# EAGLE design bms3ry (EAGLE 4.13)
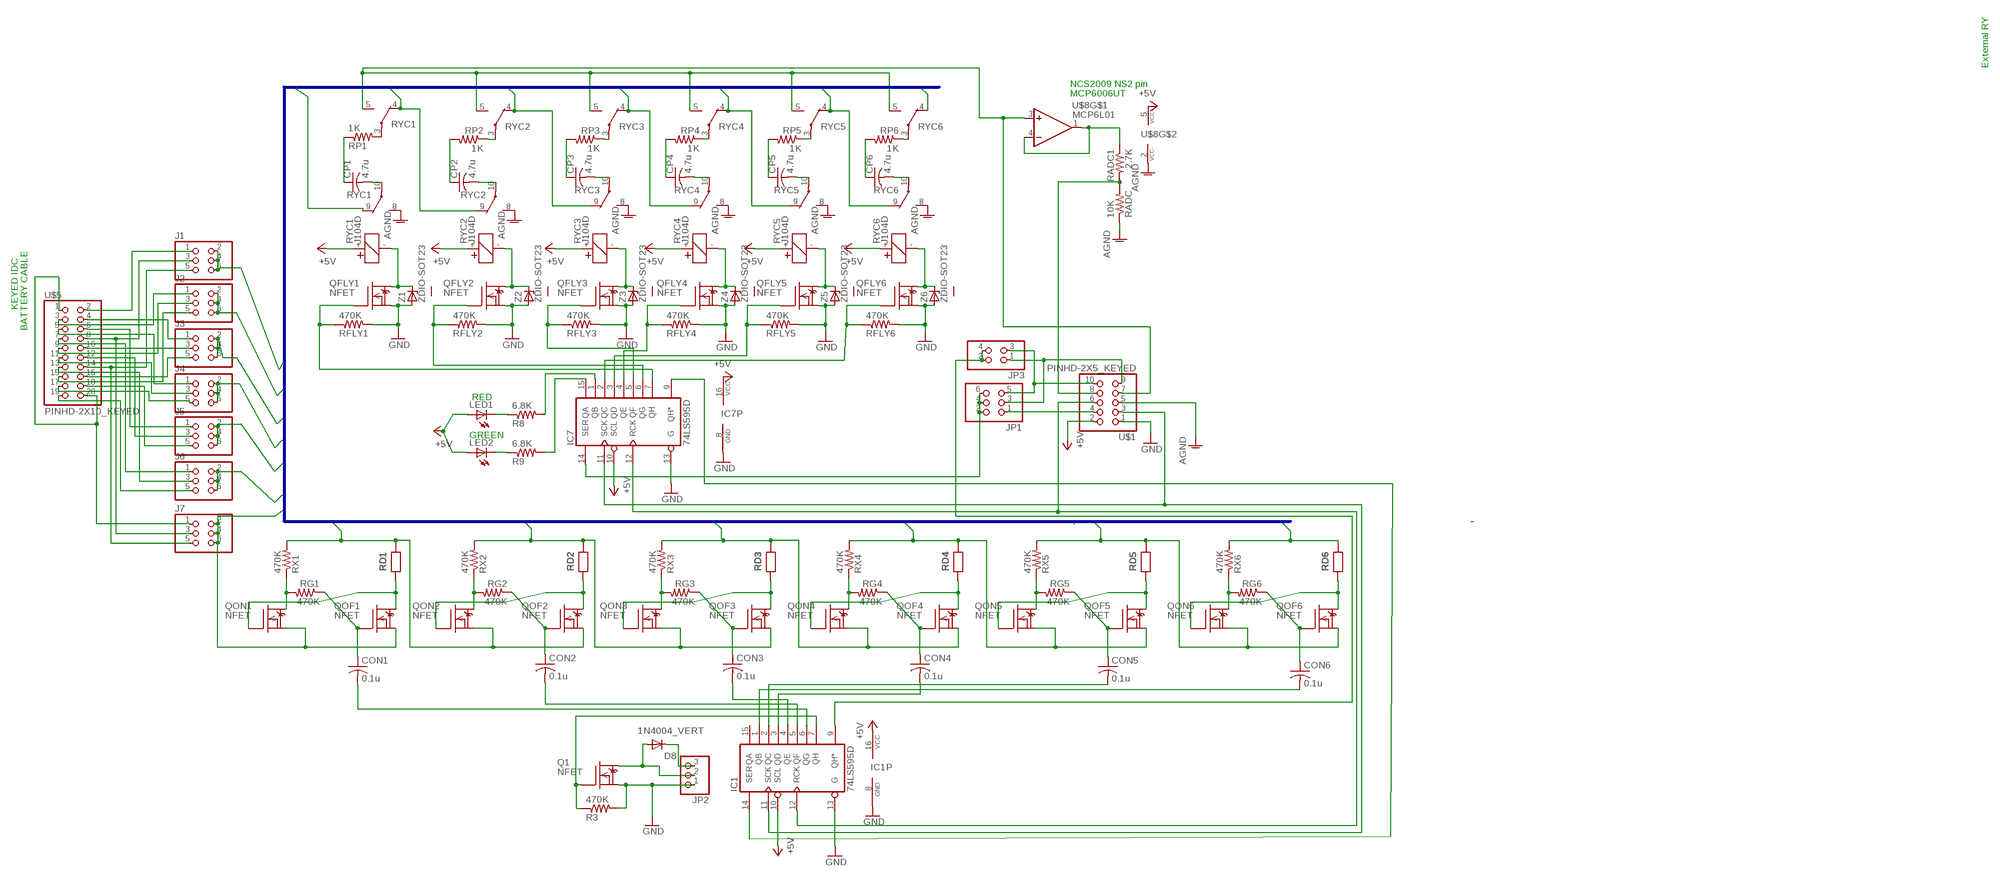
[diagram p0: schematic, sheet 1]

## Parts
CON1  0.1u  C-USC0603  [C0603]
CON2  0.1u  C-USC0603  [C0603]
CON3  0.1u  C-USC0603  [C0603]
CON4  0.1u  C-USC0603  [C0603]
CON5  0.1u  C-USC0603  [C0603]
CON6  0.1u  C-USC0603  [C0603]
CP1  4.7u  C-USC0805  [C0805]
CP2  4.7u  C-USC0805  [C0805]
CP3  4.7u  C-USC0805  [C0805]
CP4  4.7u  C-USC0805  [C0805]
CP5  4.7u  C-USC0805  [C0805]
CP6  4.7u  C-USC0805  [C0805]
D8  1N4004_VERT  [DO41-10_VERT]
IC1  74LS595D  [SO16]
IC7  74LS595D  [SO16]
J1  PINHD-2X3  [2X03]
J2  PINHD-2X3  [2X03]
J3  PINHD-2X3  [2X03]
J4  PINHD-2X3  [2X03]
J5  PINHD-2X3  [2X03]
J6  PINHD-2X3  [2X03]
J7  PINHD-2X3  [2X03]
JP1  PINHD-2X3  [2X03]
JP2  PINHD-1X3  [1X03]
JP3  PINHD-2X2  [2X02]
LED1  LEDCHIP-LED0603  [CHIP-LED0603]
LED2  LEDCHIP-LED0603  [CHIP-LED0603]
Q1  NFET  DMN3404L  [SOT-23]
QFLY1  NFET  DMN3404L  [SOT-23]
QFLY2  NFET  DMN3404L  [SOT-23]
QFLY3  NFET  DMN3404L  [SOT-23]
QFLY4  NFET  DMN3404L  [SOT-23]
QFLY5  NFET  DMN3404L  [SOT-23]
QFLY6  NFET  DMN3404L  [SOT-23]
QOF1  NFET  DMN3404L  [SOT-23]
QOF2  NFET  DMN3404L  [SOT-23]
QOF3  NFET  DMN3404L  [SOT-23]
QOF4  NFET  DMN3404L  [SOT-23]
QOF5  NFET  DMN3404L  [SOT-23]
QOF6  NFET  DMN3404L  [SOT-23]
QON1  NFET  DMN3404L  [SOT-23]
QON2  NFET  DMN3404L  [SOT-23]
QON3  NFET  DMN3404L  [SOT-23]
QON4  NFET  DMN3404L  [SOT-23]
QON5  NFET  DMN3404L  [SOT-23]
QON6  NFET  DMN3404L  [SOT-23]
R3  470K  R-US_R0603  [R0603]
R8  6.8K  R-US_R0603  [R0603]
R9  6.8K  R-US_R0603  [R0603]
RADC  10K  R-US_R0603  [R0603]
RADC1  2.7K  R-US_R0603  [R0603]
RD1  RESEU-S2,5  [RS-2,5]
RD2  RESEU-S2,5  [RS-2,5]
RD3  RESEU-S2,5  [RS-2,5]
RD4  RESEU-S2,5  [RS-2,5]
RD5  RESEU-S2,5  [RS-2,5]
RD6  RESEU-S2,5  [RS-2,5]
RFLY1  470K  R-US_R0603  [R0603]
RFLY2  470K  R-US_R0603  [R0603]
RFLY3  470K  R-US_R0603  [R0603]
RFLY4  470K  R-US_R0603  [R0603]
RFLY5  470K  R-US_R0603  [R0603]
RFLY6  470K  R-US_R0603  [R0603]
RG1  470K  R-US_R0603  [R0603]
RG2  470K  R-US_R0603  [R0603]
RG3  470K  R-US_R0603  [R0603]
RG4  470K  R-US_R0603  [R0603]
RG5  470K  R-US_R0603  [R0603]
RG6  470K  R-US_R0603  [R0603]
RP1  1K  R-US_R0603  [R0603]
RP2  1K  R-US_R0603  [R0603]
RP3  1K  R-US_R0603  [R0603]
RP4  1K  R-US_R0603  [R0603]
RP5  1K  R-US_R0603  [R0603]
RP6  1K  R-US_R0603  [R0603]
RX1  470K  R-US_R0603  [R0603]
RX2  470K  R-US_R0603  [R0603]
RX3  470K  R-US_R0603  [R0603]
RX4  470K  R-US_R0603  [R0603]
RX5  470K  R-US_R0603  [R0603]
RX6  470K  R-US_R0603  [R0603]
RYC1  J104D  [J104D]
RYC2  J104D  [J104D]
RYC3  J104D  [J104D]
RYC4  J104D  [J104D]
RYC5  J104D  [J104D]
RYC6  J104D  [J104D]
U$1  PINHD-2X5_KEYED  [2X05_KEYED]
U$5  PINHD-2X10_KEYED  [2X10_KEYED]
U$8  MCP6L01  [SOT23-5]
Z1  ZDIO-SOT23  [SOT-23]
Z2  ZDIO-SOT23  [SOT-23]
Z3  ZDIO-SOT23  [SOT-23]
Z4  ZDIO-SOT23  [SOT-23]
Z5  ZDIO-SOT23  [SOT-23]
Z6  ZDIO-SOT23  [SOT-23]

## Nets
+5V: IC1.10(SCL) IC1.16(VCC) IC7.10(SCL) IC7.16(VCC) LED1.A LED2.A RYC1.+ RYC2.+ RYC3.+ RYC4.+ RYC5.+ RYC6.+ U$1.2 U$8.5(VCC+)
AGND: RADC.1 RYC1.8(S) RYC2.8(S) RYC3.8(S) RYC4.8(S) RYC5.8(S) RYC6.8(S) U$1.5 U$8.2(VCC-)
C0: J7.2 J7.4 J7.6 QOF1.2(S) QON1.2(S) RYC1.9(O)
C1: J1.2 J1.4 J1.6 QOF2.2(S) QON2.2(S) RD1.2 RX1.2 RYC1.4(O) RYC2.9(O)
C2: J2.2 J2.4 J2.6 QOF3.2(S) QON3.2(S) RD2.2 RX2.2 RYC2.4(O) RYC3.9(O)
C3: J3.2 J3.4 J3.6 QOF4.2(S) QON4.2(S) RD3.2 RX3.2 RYC3.4(O) RYC4.9(O)
C4: J4.2 J4.4 J4.6 QOF5.2(S) QON5.2(S) RD4.2 RX4.2 RYC4.4(O) RYC5.9(O)
C5: J5.2 J5.4 J5.6 QOF6.2(S) QON6.2(S) RD5.2 RX5.2 RYC5.4(O) RYC6.9(O)
C6: J6.2 J6.4 J6.6 RD6.2 RX6.2 RYC6.4(O)
FLYCAP-COMMON: RYC1.5(S) RYC2.5(S) RYC3.5(S) RYC4.5(S) RYC5.5(S) RYC6.5(S) U$1.7 U$8.3(+IN)
FLYCAP-OPAMP-OUT: RADC1.2 RADC.2 U$1.8
GND: IC1.8(GND) IC1.13(G) IC7.8(GND) IC7.13(G) JP2.1 Q1.2(S) QFLY1.2(S) QFLY2.2(S) QFLY3.2(S) QFLY4.2(S) QFLY5.2(S) QFLY6.2(S) R3.2 RFLY1.2 RFLY2.2 RFLY3.2 RFLY4.2 RFLY5.2 RFLY6.2 U$1.1 Z1.1(A) Z2.1(A) Z3.1(A) Z4.1(A) Z5.1(A) Z6.1(A)
MOSI: JP1.1 U$1.4
N$2: IC7.6(QG) QFLY2.1(G) RFLY2.1
N$3: RP2.1 RYC2.3(P)
N$4: CP1.2 RYC1.10(P)
N$5: QON1.3(D) RG1.2 RX1.1
N$6: QON2.3(D) RG2.2 RX2.1
N$7: LED2.C R9.1
N$8: CON1.2 IC1.6(QG)
N$9: CP2.2 RYC2.10(P)
N$10: LED1.C R8.1
N$11: IC7.5(QF) QFLY3.1(G) RFLY3.1
N$12: IC7.7(QH) QFLY1.1(G) RFLY1.1
N$13: IC7.4(QE) QFLY4.1(G) RFLY4.1
N$14: IC7.3(QD) QFLY5.1(G) RFLY5.1
N$16: IC7.2(QC) QFLY6.1(G) RFLY6.1
N$17: CON2.1 QOF2.1(G) RG2.1
N$18: CON3.1 QOF3.1(G) RG3.1
N$19: CON4.2 IC1.3(QD)
N$20: CON5.1 QOF5.1(G) RG5.1
N$21: CON6.1 QOF6.1(G) RG6.1
N$22: QON3.3(D) RG3.2 RX3.1
N$23: QON4.3(D) RG4.2 RX4.1
N$25: J6.5 U$5.19
N$26: QON5.3(D) RG5.2 RX5.1
N$27: QON6.3(D) RG6.2 RX6.1
N$29: RP3.1 RYC3.3(P)
N$30: CP4.2 RYC4.10(P)
N$31: RP1.2 RYC1.3(P)
N$33: CP2.1 RP2.2
N$34: CP3.2 RYC3.10(P)
N$35: CP5.2 RYC5.10(P)
N$36: CP6.2 RYC6.10(P)
N$49: RP4.1 RYC4.3(P)
N$50: RP5.1 RYC5.3(P)
N$51: RP6.1 RYC6.3(P)
N$69: CON1.1 QOF1.1(G) RG1.1
N$70: QOF1.3(D) QON1.1(G) RD1.1
N$75: QOF2.3(D) QON2.1(G) RD2.1
N$77: CON5.2 IC1.2(QC)
N$81: QOF3.3(D) QON3.1(G) RD3.1
N$86: CON4.1 QOF4.1(G) RG4.1
N$87: QOF4.3(D) QON4.1(G) RD4.1
N$89: QOF5.3(D) QON5.1(G) RD5.1
N$96: CON2.2 IC1.5(QF)
N$98: CON3.2 IC1.4(QE)
N$101: RADC1.1 U$8.1(OUT) U$8.4(-IN)
N$106: CP1.1 RP1.1
N$107: CP3.1 RP3.2
N$109: CP4.1 RP4.2
N$110: CP5.1 RP5.2
N$111: CP6.1 RP6.2
N$127: QOF6.3(D) QON6.1(G) RD6.1
N$129: CON6.2 IC1.1(QB)
NSS-RCLK: IC1.12(RCK) IC7.12(RCK) U$1.6
Q1-D-RY: D8.A JP2.2 Q1.3(D)
Q1-DIODE: D8.C JP2.3
QDFLY1: QFLY1.3(D) RYC1.- Z1.3(C)
QDFLY2: QFLY2.3(D) RYC2.- Z2.3(C)
QDFLY3: QFLY3.3(D) RYC3.- Z3.3(C)
QDFLY4: QFLY4.3(D) RYC4.- Z4.3(C)
QDFLY5: QFLY5.3(D) RYC5.- Z5.3(C)
QDFLY6: QFLY6.3(D) RYC6.- Z6.3(C)
SCLK-SCLK: IC1.11(SCK) IC7.11(SCK) U$1.3
SER1: JP1.3 JP3.1 U$1.9
SER1OUT: IC1.14(SER) IC7.9(QH*)
SER2: JP1.5 JP3.3 U$1.10
SER2-LED-GRN: IC7.15(QA) R9.2
SER-IN: IC7.14(SER) JP1.2 JP1.4 JP1.6
SER-OUT: IC1.9(QH*) JP3.2 JP3.4
SR1-FETGATE: IC1.7(QH) Q1.1(G) R3.1
SR2-LED-RED: IC7.1(QB) R8.2
Z0: J7.1 U$5.1 U$5.20
Z1: J1.1 U$5.2
Z2: J2.1 U$5.3
Z3: J3.1 U$5.4
Z4: J4.1 U$5.5
Z5: J5.1 U$5.6
Z6: J6.1 U$5.7
Z7: J1.3 J7.3 U$5.8
Z8: J2.3 U$5.9
Z9: J3.3 U$5.10
Z10: J4.3 U$5.11
Z11: J5.3 U$5.12
Z12: J6.3 U$5.13
Z13: J1.5 J7.5 U$5.14
Z14: J2.5 U$5.15
Z15: J3.5 U$5.16
Z16: J4.5 U$5.17
Z17: J5.5 U$5.18
Unconnected: IC1.15(QA) Z1.2(NC) Z2.2(NC) Z3.2(NC) Z4.2(NC) Z5.2(NC) Z6.2(NC)

## Buses
C$1:C[0..18]

## Notes on the sheet
- External RY
- NCS2009 NS2 pin
- MCP6006UT
- BATTERY CABLE
- KEYED IDC
- RED
- GREEN

## Library data of the parts
CON1-CON6 CP1-CP6 = rcl:C-US: CAPACITOR, American symbol
D8 = diode:1N4004_VERT
IC1 IC7 = 74xx-us:74*595: 8-bit SHIFT REGISTER, output latch
J1-J7 JP1 = pinhead:PINHD-2X3: PIN HEADER
JP2 = pinhead:PINHD-1X3: PIN HEADER
JP3 = pinhead:PINHD-2X2: PIN HEADER
LED1 LED2 = led:LED: LED OSRAM: - CHIPLED LG R971, LG N971, LY N971, LG Q971, LY Q971, LO R971, LY R971 LH N974, LH R974 LS Q976, LO Q976, LY Q976 LO Q996 - Hyper CHIPLED LW Q18S LB Q993, LB Q99A, LB R99A - SideLED LS A670, LO A670, LY A670, LG A670, LP A670 LB A673, LV A673, LT A673, LW A673 LH A674 LY A675 LS A676, LA A676, LO A676, LY A676, LW A676 LS A679, LY A679, LG A679 - Hyper Micro SIDELED® LS Y876, LA Y876, LO Y876, LY Y876 LT Y87S - SmartLED LW L88C, LW L88S LB L89C, LB L89S, LG L890 LS L89K, LO L89K, LY L89K LS L896, LA L896, LO L896, LY L896 - TOPLED LS T670, LO T670, LY T670, LG T670, LP T670 LSG T670, LSP T670, LSY T670, LOP T670, LYG T670 LG T671, LOG T671, LSG T671 LB T673, LV T673, LT T673, LW T673 LH T674 LS T676, LA T676, LO T676, LY T676, LB T676, LH T676, LSB T676, LW T676 LB T67C, LV T67C, LT T67C, LS T67K, LO T67K, LY T67K, LW E67C LS E67B, LA E67B, LO E67B, LY E67B, LB E67C, LV E67C, LT E67C LW T67C LS T679, LY T679, LG T679 LS T770, LO T770, LY T770, LG T770, LP T770 LB T773, LV T773, LT T773, LW T773 LH T774 LS E675, LA E675, LY E675, LS T675 LS T776, LA T776, LO T776, LY T776, LB T776 LHGB T686 LT T68C, LB T68C - Hyper Mini TOPLED® LB M676 - Mini TOPLED Santana® LG M470 LS M47K, LO M47K, LY M47K Source: http://www.osram.convergy.de/
Q1 QFLY1-QFLY6 QOF1-QOF6 QON1-QON6 = transistor-fet:DMN3404L
R3 R8 R9 RADC RADC1 RFLY1-RFLY6 RG1-RG6 RP1-RP6 RX1-RX6 = rcl:R-US_: RESISTOR, American symbol
RD1-RD6 = DEH:RESEU-S2,5
RYC1-RYC6 = relay:J104D
U$1 = pinhead:PINHD-2X5_KEYED
U$5 = pinhead:PINHD-2X10_KEYED
U$8 = op-amp:MCP6L01
Z1-Z6 = DEH:ZDIO-SOT23

## Board
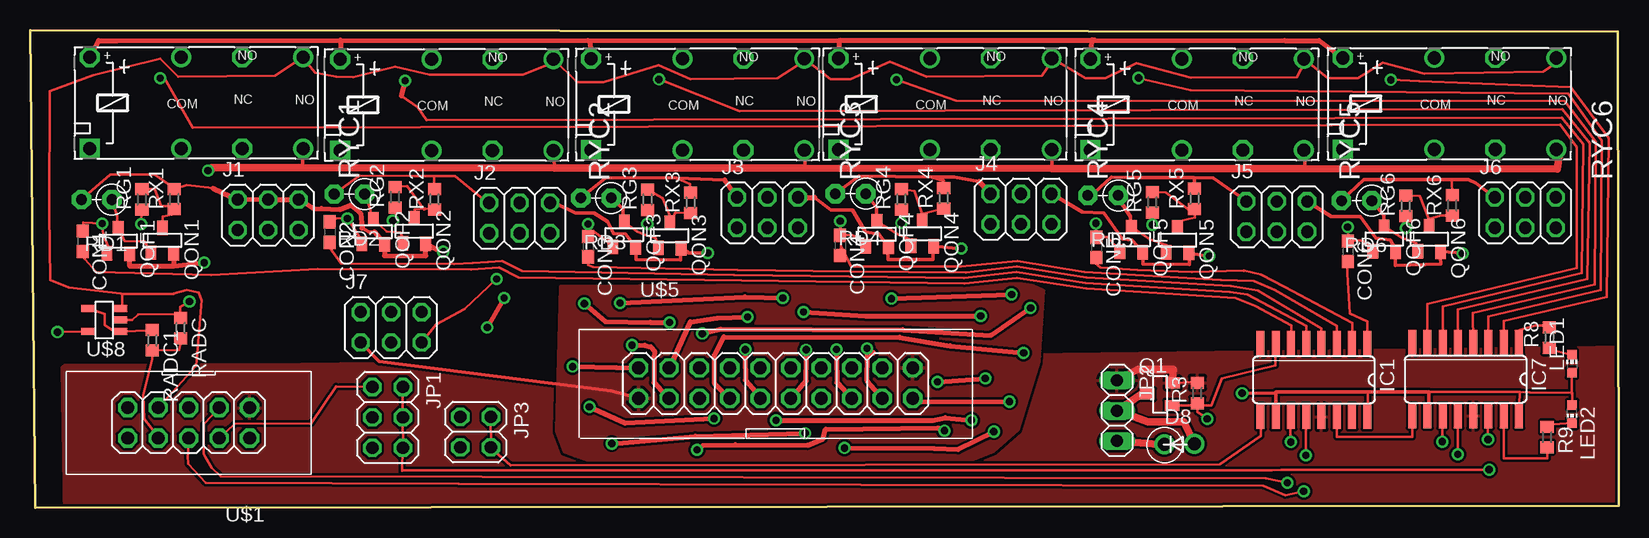
[diagram p1: board, top side]
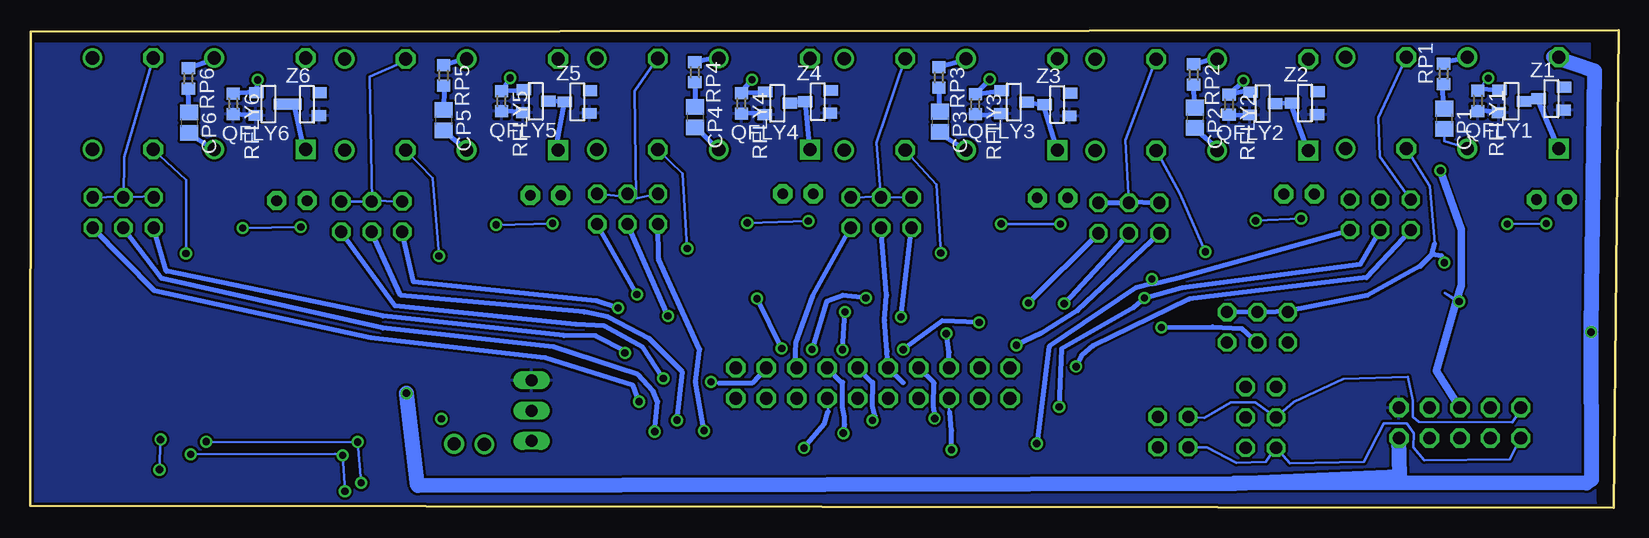
[diagram p2: board, bottom side, seen from below]

Size 132.42 x 39.85 mm. Coordinates in mm from the lower left corner, seen from the top.
Outline: 0.42,0 0,39.85 132.35,39.69 132.42,0.17 0.42,0
Copper layers (1*16): Top 0.035mm / dielectric 1.5mm / Bottom 0.035mm
Design rules "default": minimum track width 8mil, minimum drill 0.6mm, track to track 8mil, track to pad 8mil, pad to pad 8mil, via to via 8mil, smd to smd 0mil, copper to edge 8mil, drill to drill 8mil, minimum pad ring 10mil, minimum via ring 8mil, stop-mask expansion 4mil, vias tented up to drill 0mil, thermal gap 10mil

### Footprints (pad centres in the part's own frame; a part is rotated, then mirrored left to right if it is on the bottom)
C0603 = smd 1.1 x 1: 1 -0.85,0; 2 0.85,0
C0805 = smd 1.3 x 1.5: 1 -0.85,0; 2 0.85,0
DO41-10_VERT = drill 1.1 round: A 2.58,0.05; C 0.07,0
SO16 = smd 0.66 x 2.032: 1 -4.445,-3.073; 2 -3.175,-3.073; 3 -1.905,-3.073; 4 -0.635,-3.073; 5 0.635,-3.073; 6 1.905,-3.073; 7 3.175,-3.073; 8 4.445,-3.073; 9 4.445,3.073; 10 3.175,3.073; 11 1.905,3.073; 12 0.635,3.073; 13 -0.635,3.073; 14 -1.905,3.073; 15 -3.175,3.073; 16 -4.445,3.073
2X03 = drill 1.016 octagon: 1 -2.54,-1.27; 2 -2.54,1.27; 3 0,-1.27; 4 0,1.27; 5 2.54,-1.27; 6 2.54,1.27
1X03 = drill 1 long: 1 -2.54,0; 2 0,0; 3 2.54,0
2X02 = drill 1.016 octagon: 1 -1.27,-1.27; 2 -1.27,1.27; 3 1.27,-1.27; 4 1.27,1.27
CHIP-LED0603 = smd 0.8 x 0.8: A 0,-0.75; C 0,0.75
SOT-23 = smd 0.9 x 1.2: 1 -1,-1.006; 2 0.9,-1.056; 3 -0.05,1.056
R0603 = smd 1 x 1.1: 1 -0.85,0; 2 0.85,0
RS-2,5 = drill 0.889 pad 1.6 octagon: 1 0,0; 2 2.54,0
J104D = drill 1.1 round: 3 0,6.35; 5 10.16,6.35; 8 10.16,-1.27; 10 0,-1.27 | drill 1.1 octagon: 4 5.08,6.35; 9 5.08,-1.27; + -7.62,6.35 | drill 1.1 square: - -7.62,-1.27
2X05_KEYED = drill 1.067 octagon: 1 -5.08,-1.27; 2 -5.08,1.27; 3 -2.54,-1.27; 4 -2.54,1.27; 5 0,-1.27; 6 0,1.27; 7 2.54,-1.27; 8 2.54,1.27; 9 5.08,-1.27; 10 5.08,1.27
2X10_KEYED = drill 1.067 octagon: 1 -11.46,-1.27; 2 -11.46,1.27; 3 -8.92,-1.27; 4 -8.92,1.27; 5 -6.38,-1.27; 6 -6.38,1.27; 7 -3.84,-1.27; 8 -3.84,1.27; 9 -1.3,-1.27; 10 -1.3,1.27; 11 1.24,-1.27; 12 1.24,1.27; 13 3.78,-1.27; 14 3.78,1.27; 15 6.32,-1.27; 16 6.32,1.27; 17 8.86,-1.27; 18 8.86,1.27; 19 11.4,-1.27; 20 11.4,1.27
SOT23-5 = smd 0.6 x 1.2: 1 -0.95,-1.306; 2 0,-1.306; 3 0.95,-1.306; 4 0.95,1.306; 5 -0.95,1.306

### Placement (x,y rotation side)
CON1  4.38,22.23 270 top
CON2  24.99,23 270 top
CON3  46.51,21.78 270 top
CON4  67.54,21.88 270 top
CON5  88.9,21.71 270 top
CON6  109.84,21.39 270 top
CP1  14.54,32.44 270 bottom
CP2  35.31,32.52 270 bottom
CP3  56.57,32.19 270 bottom
CP4  76.97,32.58 270 bottom
CP5  97.94,32.33 270 bottom
CP6  119.16,32.11 270 bottom
D8  94.48,5.28 0 top
IC1  107.02,10.66 180 top
IC7  119.67,10.72 180 top
J1  19.85,24.43 0 top
J2  40.81,24.16 0 top
J3  61.47,24.62 0 top
J4  82.6,24.92 0 top
J5  103.93,24.28 0 top
J6  124.64,24.62 0 top
J7  30.1,15.05 0 top
JP1  29.81,7.53 270 top
JP2  90.61,8.1 270 top
JP3  37.14,6.31 270 top
LED1  128.53,12.01 0 top
LED2  128.55,7.82 180 top
Q1  94.19,9.52 90 top
QFLY1  8.93,33.85 270 bottom
QFLY2  29.68,33.66 270 bottom
QFLY3  50.4,33.78 270 bottom
QFLY4  70.13,33.69 270 bottom
QFLY5  90.26,33.86 270 bottom
QFLY6  112.55,33.62 270 bottom
QOF1  7.41,22.24 0 top
QOF2  28.67,23.02 0 top
QOF3  49.59,22.78 0 top
QOF4  70.66,22.82 0 top
QOF5  91.85,22.36 0 top
QOF6  112.93,22.4 0 top
QON1  11.09,22.29 0 top
QON2  32.08,23.07 0 top
QON3  53.38,22.7 0 top
QON4  74.43,22.87 0 top
QON5  95.7,22.32 0 top
QON6  116.68,22.41 0 top
R3  97.31,9.57 90 top
R8  126.65,14.2 90 top
R9  126.46,5.89 270 top
RADC  12.55,14.99 270 top
RADC1  10.19,13.96 270 top
RD1  6.83,25.71 180 top
RD2  27.9,26.16 180 top
RD3  48.45,25.84 180 top
RD4  69.67,26.19 180 top
RD5  90.72,26.05 180 top
RD6  111.86,25.61 180 top
RFLY1  11.73,33.95 270 bottom
RFLY2  32.47,33.62 270 bottom
RFLY3  53.62,33.66 270 bottom
RFLY4  73.12,33.73 270 bottom
RFLY5  93.11,33.91 270 bottom
RFLY6  115.48,33.69 270 bottom
RG1  9.33,25.71 90 top
RG2  30.43,25.9 90 top
RG3  51.48,25.69 90 top
RG4  72.64,25.73 90 top
RG5  93.55,25.48 90 top
RG6  114.68,25.17 90 top
RP1  14.58,36.19 90 bottom
RP2  35.42,36.13 270 bottom
RP3  56.66,35.89 270 bottom
RP4  77,36.33 270 bottom
RP5  97.94,36.06 270 bottom
RP6  119.21,35.82 270 bottom
RX1  12.02,25.75 90 top
RX2  33.72,25.73 90 top
RX3  55.07,25.45 90 top
RX4  76.16,25.82 90 top
RX5  97.07,25.78 90 top
RX6  118.55,25.21 90 top
RYC1  12.6,31.22 0 top
RYC2  33.47,31.06 0 top
RYC3  54.39,31.1 0 top
RYC4  75.01,31.13 0 top
RYC5  96.02,31.09 0 top
RYC6  117.06,31.16 0 top
U$1  13.22,7.08 180 top
U$5  62.18,10.39 0 top
U$8  6.19,15.66 90 top
Z1  5.6,34.17 90 bottom
Z2  26.14,33.8 90 bottom
Z3  46.78,33.68 90 bottom
Z4  66.74,33.91 90 bottom
Z5  86.79,33.9 90 bottom
Z6  109.33,33.71 90 bottom

### Tracks (layer width: path | path; a pad name or v marks a point on that pad's centre or on a via)
+5V  (via drill 0.6)
  Top 0.203: 116.59,9.67 124.17,9.64 | 124.17,9.64 125.02,9.64 128.55,9.59 LED2.A 128.53,10.23 LED1.A | 124.17,9.64 124.17,9.6 IC7.16 | 111.5,9.66 111.5,9.7 IC1.16 | v2.29,14.65 U$8.5
  Top 0.305: 103.85,9.58 IC1.10 | 103.85,9.58 103.85,9.65 111.5,9.66 116.59,9.67 116.56,7.69 IC7.10 | 103.85,9.58 103.89,9.58 v101.04,9.55
  Top 0.406: RYC1.+ 5.72,38.96 7.24,38.95 25.86,39 | RYC6.+ 107.47,38.96 104.59,38.96 88.75,39.01 | 25.86,39 46.51,38.97 | 46.51,38.97 67.59,38.99 | 67.59,38.99 88.75,39.01 | 25.86,39 25.89,38.95 RYC2.+ | 46.51,38.97 46.68,38.82 RYC3.+ | 67.59,38.99 67.44,38.94 RYC4.+ | 88.75,39.01 88.48,39.02 RYC5.+
  Bottom 0.203: 32,2.04 32,2.01 | 2.28,14.91 2.63,17.23 v2.29,14.65
  Bottom 1.27: U$1.2 18.25,2.61 32,2.04 2.67,2.06 2.25,2.36 2.28,14.91 2,36.42 5.41,37.58 RYC1.+ | v101.04,9.55 100.1,1.85 32,2.01
AGND  (via drill 0.6)
  Top 0.203: U$8.2 8.52,15.65 9,16.11 12.51,16.16 | 12.51,16.16 RADC.1 | 12.51,16.16 12.51,16.73 v13.29,17.21
  Top 0.305: 106.31,28.28 106.31,28.23 RYC5.8 | 85.17,28.3 85.17,28.2 RYC4.8 | 64.62,28.33 64.62,28.29 RYC3.8 | 43.72,28.35 43.72,28.38 RYC2.8 | 22.74,28.37 22.74,28.38 RYC1.8
  Top 0.61: v14.84,28.13 15.16,28.38 22.74,28.37 43.72,28.35 64.62,28.33 85.17,28.3 106.31,28.28 127.32,28.26 127.51,29.65 RYC6.8
  Bottom 0.203: 13.54,17.26 14.47,17.92 v13.29,17.21
  Bottom 0.61: U$1.5 15.18,11.4 13.54,17.26 13.09,18.53 13.09,23.22 v14.84,28.13
C0  (via drill 0.6)
  Top 0.203: 12.08,21.19 QON1.2
  Top 0.406: QOF1.2 8.32,20.16 12.04,20.18 | 12.04,20.18 12.08,21.19 | 12.04,20.18 v14.52,20.44
  Bottom 0.203: RYC1.9 15.75,26.85 15.33,22.02 | 27.73,16.36 J7.2 | 30.2,16.26 J7.4 | 32.78,16.29 J7.6 | 14.44,20.47 14.4,20.41 | 14.44,20.47 14.75,21 | 14.44,20.47 14.46,20.46 v14.52,20.44
  Bottom 0.406: 15.55,21.13 16.51,20.15 20.94,17.72 27.73,16.36 30.2,16.26 | 15.55,21.13 15.33,22.02 | J7.4 32.78,16.29 | 14.75,21 15.55,21.13
C1  (via drill 0.6)
  Top 0.203: 15.33,26.62 15.36,26.69 | RD1.2 6.69,27.79 10.39,27.79 12.08,26.62 RX1.2 13.08,26.9 15.26,26.65 | 32.96,22.01 QON2.2 | 34.44,21.32 v34.45,21.35 | 29.5,22.05 QOF2.2
  Top 0.305: 27.68,23.32 28.26,23.01 28.72,23
  Top 0.406: J1.2 17.47,25.73 | J1.2 19.92,25.75 J1.4 J1.6 22.54,25.7 23.7,24.92 24.3,24.96 25.81,24.89 26.72,25.24 27.56,24.57 27.68,23.32 | J1.2 17.34,25.68 15.33,26.62 15.26,26.65 | QOF2.2 29.56,21.02 32.98,21.01 32.96,22.01 | QON2.2 34.44,21.32 | 28.72,23 29.5,22.05
  Bottom 0.203: RYC1.4 20.01,32.52 19.9,29.29 17.33,25.67 J1.2 | v34.45,21.35 36.56,26.22 38.55,29.88 RYC2.9
C2  (via drill 0.6)
  Top 0.203: RD2.2 27.48,27.71 32.05,27.68 33.69,27.68 | 33.69,27.68 35.44,27.68 38.28,25.33 J2.2 | 33.69,27.68 33.69,27.6 RX2.2
  Top 0.305: 43.75,25.43 45.47,24.57 47,24.58 48.14,23.87 48.64,22.88 49.64,22.82 50.52,21.72 50.53,20.69 54.24,20.67 54.26,21.66 QON3.2 54.94,21.25 v56.5,21.24
  Top 0.406: 38.38,25.33 J2.2 38.32,25.39 | J2.6 43.39,25.44 43.75,25.43 | 50.52,21.72 QOF3.2
  Bottom 0.203: RYC2.4 41.09,30.68 40.83,25.41 J2.4 41.03,25.5 | 42.9,25.42 J2.6 | RYC3.9 56.87,26.96 v56.5,21.24
  Bottom 0.406: J2.4 42.9,25.42 | J2.2 41.03,25.5
C3  (via drill 0.6)
  Top 0.203: 53.9,27.48 55.02,26.99 55.11,26.29
  Top 0.305: RD3.2 48.02,27.55 53.88,27.5 53.9,27.48 53.91,27.49 57.91,27.33 | 55.11,26.29 RX3.2 | 65.4,25.88 66.78,24.83 68.58,24.84 69.66,22.98 70.78,22.84 71.53,21.74 QOF4.2 71.53,20.71 75.27,20.71 75.31,21.81 QON4.2 77.67,21.59 v77.63,21.63
  Top 0.406: J3.6 65.4,25.88 | 57.91,27.33 J3.2
  Bottom 0.203: RYC3.4 61.86,30.45 61.48,25.87 | 61.48,25.87 J3.4 61.63,25.96 J3.6 | J3.2 58.89,25.93 61.48,25.87 | RYC4.9 78.04,27.89 v77.63,21.63
C4  (via drill 0.6)
  Top 0.203: 76.16,27.3 76.18,26.68
  Top 0.305: RD4.2 69.11,27.65 75.17,27.58 | 75.17,27.58 76.16,27.3 | 76.18,26.68 RX4.2 | 79.12,27.22 77.08,27.6 75.17,27.58 | J4.6 87.74,24.65 89.53,24.59 91.06,22.42 91.84,22.33 92.76,21.33 QOF5.2 92.76,20.34 96.64,20.29 96.6,21.28 QON5.2 98.35,20.95 v98.33,21
  Top 0.406: J4.2 80.11,26.19 79.12,27.22
  Bottom 0.203: RYC4.4 82.02,34.74 81.9,25.81 J4.4 | J4.4 81.85,25.81 J4.6 | J4.4 81.79,25.81 J4.2 | RYC5.9 98.87,27.51 v98.33,21
C5  (via drill 0.6)
  Top 0.203: RX5.2 97.38,26.52
  Top 0.305: 88.22,25.85 90.14,27.56 91.77,27.53 97,27.52 | J5.6 108.46,24.27 110.89,24.29 112.2,22.51 113.4,22.31 113.93,21.39 QOF6.2 113.82,20.22 117.6,20.32 117.54,21.36 QON6.2 119.5,21.24 v119.42,21.21 | 101.56,25.5 99.78,26.72 98.65,27.48 97,27.52 | RX5.2 97.16,26.64 97,27.52 | 97,27.52 97.02,27.45
  Top 0.406: RD5.2 88.22,25.85 | 101.56,25.5 J5.2
  Bottom 0.203: 101.13,37.23 104.1,35.96 103.88,25.52 J5.4 | J5.4 103.88,25.55 | J5.4 J5.6 | J5.4 104.08,25.61 J5.2 | RYC6.9 119.38,27.31 v119.42,21.21
  Bottom 0.406: 101.13,37.23 RYC5.4
C6
  Top 0.203: 118.54,27.37 118.54,27.34 RX6.2
  Top 0.305: J6.2 120.5,27.08 120.5,27.07 119.9,27.37 118.54,27.37 111.2,27.36 RD6.2
  Bottom 0.203: J6.4 124.85,25.96 J6.6 | J6.2 122.14,26.01 J6.4 | RYC6.4 124.56,29.23 124.62,25.77 J6.4
FLYCAP-COMMON
  Top 0.203: 43.88,37.25 41.09,36.12 33.33,36.11 30.43,36.78 26.95,35.92 25.54,35.95 23.77,36.29 22.72,37.55 22.74,37.56 | RYC2.5 45.62,35.51 47.8,35.51 52.41,36.91 55.05,35.74 62.3,35.83 64.51,37.25 | RYC3.5 66.72,35.73 68.39,35.73 71.7,37.19 74.72,35.97 84.35,36.04 85.4,37.54 | RYC4.5 87.99,35.84 89.65,35.81 92.24,37.07 96.77,35.87 105.62,35.93 106.28,37.17 | RYC5.5 108.2,35.81 110.67,35.84 112.75,37.14 116.21,36.19 126.13,36.36 127.37,37.19 RYC6.5 | 7.55,17.86 3.22,18.39 1.69,19.01 1.61,24.58 1.66,34.74 5.28,36.1 10.85,37.45 12.34,35.95 20.42,36.03 22.74,37.56 | 7.7,17.84 7.55,17.86 | U$8.3 7.67,16.53 7.7,17.84 | 7.55,17.86 7.55,17.87 | 11.96,17.86 13.08,18.17 14.06,17.96 14.3,17.29 14.32,17.33 13.85,11.81 U$1.7 | 11.96,17.86 11.93,17.85 | 11.96,17.86 11.97,17.84 7.7,17.84 | 22.74,37.56 RYC1.5
  Top 0.406: 43.88,37.25 RYC2.5 | 64.51,37.25 RYC3.5 | 85.4,37.54 RYC4.5 | 106.28,37.17 RYC5.5
FLYCAP-OPAMP-OUT
  Top 0.203: RADC.2 12.64,14.15 12.45,13.18 RADC1.2 10.17,12.39 9.43,9.41 9.5,7.41 10.82,5.75 U$1.8
GND
  Top 0.203: R3.2 97.37,10.48 Q1.2
  Top 0.61: JP2.1 92.36,11.54 95.31,11.52 95.2,10.42 Q1.2
  Bottom 0.406: QFLY6.2 113.56,32.7 RFLY6.2 | QFLY5.2 91.22,33 RFLY5.2 | QFLY4.2 71.12,32.93 RFLY4.2 | RFLY3.2 53.64,32.7 QFLY3.2 | RFLY2.2 32.39,32.7 QFLY2.2 | RFLY1.2 11.99,33.21 QFLY1.2
  pour Top (rank 3): 2.9,11.9 22.66,12 133.67,13.47 133.61,-1.45 22.97,-1.09 2.86,-0.75 2.66,11.69
  pour Bottom (rank 3): 2.38,38.72 133.21,38.72 133.15,-1.14 1.89,-1.14
MOSI
  Top 0.203: JP1.1 25.54,10.11 23.42,7.05 17.06,6.98 15.74,5.75 U$1.4
N$2  (via drill 0.6)
  Top 0.203: IC7.6 117.75,16.8 129.37,19.56 129.46,30.35 127.68,32.53 33.05,32.32 32.3,33.41 30.94,34.36
  Top 0.406: v31.27,35.62 30.94,34.36
  Bottom 0.406: QFLY2.1 30.96,34.8 32.59,34.43 RFLY2.1 32.43,34.48 v31.27,35.62
N$3
  Bottom 0.406: RP2.1 35.55,36.91 33.51,37.56 RYC2.3
N$4
  Bottom 0.203: CP1.2 14.51,30.58 12.48,29.95 RYC1.10
N$5
  Top 0.203: RG1.2 10.41,26.56 10.94,25.17 12.14,25.15 RX1.1 12.06,24.5 11.06,24.27 QON1.3
N$6
  Top 0.203: RG2.2 31.44,26.84 32.85,24.89 32.93,24.9 | RX2.1 33.76,24.96 32.93,24.9 | QON2.3 32.07,24.89 32.93,24.94 32.93,24.9
N$7
  Top 0.203: R9.1 126.47,6.93 LED2.C
N$8
  Top 0.203: IC1.6 105.13,15.19 102.15,16.81 100.47,17.48 88.06,18.28 82.29,19.17 77.91,18.72 40.74,19.22 39.1,20.05 36.77,19.87 23.99,19.92 15.1,19.41 5.53,19.66 4.55,20.76 4.34,21.39 CON1.2
N$9
  Bottom 0.406: RYC2.10 33.51,30.04 35.38,31.68 CP2.2
N$10
  Top 0.203: R8.1 126.67,13.19 LED1.C
N$11  (via drill 0.6)
  Top 0.203: IC7.5 119.01,16.54 129.81,19.1 130.01,30.4 127.74,33.26 59.13,33.09 v52.42,35.73
  Bottom 0.406: QFLY3.1 53.71,34.5 RFLY3.1 53.62,34.46 v52.42,35.73
N$12  (via drill 0.6)
  Top 0.203: IC7.7 116.48,16.98 128.92,19.99 128.95,30.07 127.56,31.94 13.58,31.69 11.17,35.87 v10.85,35.84
  Bottom 0.203: 11.72,34.91 v10.85,35.84
  Bottom 0.406: QFLY1.1 11.85,34.91 RFLY1.1 11.72,34.91
N$13  (via drill 0.6)
  Top 0.203: IC7.4 120.29,16.23 130.42,18.63 130.53,30.55 127.94,33.91 77.2,33.96 v72.24,35.7
  Bottom 0.406: QFLY4.1 71.05,34.63 RFLY4.1 73.17,34.62 v72.24,35.7
N$14  (via drill 0.6)
  Top 0.203: IC7.3 121.56,15.95 130.94,18.16 131.04,30.64 128.22,34.53 96.74,34.85 v92.41,35.85
  Bottom 0.406: QFLY5.1 91.39,34.77 RFLY5.1 93.12,34.69 v92.41,35.85
N$16  (via drill 0.6)
  Top 0.203: IC7.2 122.84,15.56 131.42,17.56 131.59,30.84 128.43,35.1 115.8,35.58 v113.44,35.69
  Bottom 0.406: v113.44,35.69 113.56,34.67 QFLY6.1 113.7,34.67 RFLY6.1
N$17  (via drill 0.6)
  Top 0.203: RG2.1 30.49,24.31 v30.25,23.94 | CON2.1 25.53,24.13 26.59,24.15 v26.46,24.12 27.4,22.72 27.68,22.11 QOF2.1
  Bottom 0.203: v26.46,24.12 v30.25,23.94
N$18  (via drill 0.6)
  Top 0.203: QOF3.1 48.61,21.8 48.05,22.23 47.05,22.98 CON3.1 46.53,22.59 v46.52,23.67 | v51.46,23.68 RG3.1
  Bottom 0.203: v46.52,23.67 v51.46,23.68
N$19
  Top 0.203: IC1.3 108.93,15.16 103.77,18.16 102.04,18.9 99.27,18.98 87.89,19.68 82.3,20.6 77.59,20.14 68.43,20.14 67.62,21.83 CON4.2
N$20  (via drill 0.6)
  Top 0.203: v93.57,23.6 RG5.1 | v88.86,23.72 88.85,22.83 CON5.1 89.83,22.56 90.47,21.89 90.83,21.4 QOF5.1
  Bottom 0.203: v88.86,23.72 v93.57,23.6
N$21  (via drill 0.6)
  Top 0.203: v114.69,23.34 RG6.1 | CON6.1 109.88,22.27 | 109.88,22.27 v109.84,23.42 | 109.88,22.27 111.04,22.27 111.57,21.94 111.88,21.37 QOF6.1
  Bottom 0.203: v109.84,23.42 v114.69,23.34
N$22
  Top 0.203: RG3.2 52.73,25.81 53.34,24.31 53.35,23.76 QON3.3 53.4,23.82 53.83,24.62 RX3.1
N$23
  Top 0.203: RG4.2 73.73,26.42 74.37,24.55 | QON4.3 74.49,23.98 74.37,24.55 | 74.37,24.55 74.46,24.52 RX4.1
N$25  (via drill 0.6)
  Top 0.203: U$5.19 73.6,9.08 74.19,8.87
  Top 0.406: 74.19,8.87 v81.65,8.85
  Bottom 0.406: v81.65,8.85 82.15,10.21 89.48,12.5 104.02,14.18 122.03,18.09 J6.5
N$26
  Top 0.203: QON5.3 95.7,23.88 97.12,24.21 RX5.1 97.13,24.9 96.68,24.8 94.7,26.3 RG5.2
N$27
  Top 0.203: RG6.2 115.86,25.98 116.6,24.09 116.6,24.07 | QON6.3 116.66,23.47 116.6,24.07 | RX6.1 117.59,24.36 116.62,24.07 116.6,24.07
N$29
  Bottom 0.406: RP3.1 56.7,36.74 54.39,37.32 RYC3.3
N$30
  Bottom 0.406: CP4.2 77.04,31.78 RYC4.10
N$31
  Bottom 0.406: RP1.2 14.64,37.12 12.53,37.52 RYC1.3
N$33
  Bottom 0.406: RP2.2 35.48,35.11 CP2.1
N$34
  Bottom 0.406: CP3.2 56.67,31.23 RYC3.10
N$35
  Bottom 0.406: CP5.2 97.98,31.44 RYC5.10
N$36
  Bottom 0.406: CP6.2 119.37,31.3 RYC6.10
N$49
  Bottom 0.406: RYC4.3 75.07,37.59 RP4.1
N$50
  Bottom 0.406: RYC5.3 96.18,37.42 RP5.1
N$51
  Bottom 0.406: RYC6.3 117.23,37.35 RP6.1
N$69  (via drill 0.6)
  Top 0.203: v9.27,23.66 RG1.1 | CON1.1 4.4,22.88 4.42,23.77 v6.02,23.7 6.11,22.75 6.5,21.8 6.46,21.26 QOF1.1
  Bottom 0.203: v6.02,23.7 v9.27,23.66
N$70
  Top 0.203: RD1.1 7.26,24.33 7.3,23.25 QOF1.3 7.9,22.23 9.57,22.21 10.02,21.32 QON1.1
N$75
  Top 0.203: RD2.1 28.39,24.85 28.5,24.03 QOF2.3 29.71,23.04 30.91,22.96 31.18,22.15 QON2.1
N$77
  Top 0.203: IC1.2 110.22,15.43 104.61,18.43 102.59,19.47 101.2,19.78 | 101.2,19.78 101.17,19.78 96.87,19.66 92.32,19.82 89.22,20.03 88.52,20.62 88.52,21.3 CON5.2 | 101.2,19.78 101.2,19.76
N$81
  Top 0.203: QOF3.3 50.62,23.04 51.32,22.74 52.13,22.51 52.39,21.73 QON3.1
  Top 0.305: RD3.1 49.43,24.94 49.47,23.84 QOF3.3
N$86  (via drill 0.6)
  Top 0.203: v72.63,23.76 RG4.1 | v67.54,23.9 67.59,23.7 CON4.1 68.5,22.74 69.3,22.31 QOF4.1
  Bottom 0.203: v67.54,23.9 v72.63,23.76
N$87
  Top 0.203: QOF4.3 72.3,22.82 73.48,22.35 QON4.1
  Top 0.305: RD4.1 70.56,25.02 70.62,23.91 QOF4.3
N$89
  Top 0.203: QOF5.3 93.39,22.39 94.72,21.9 94.72,21.3 QON5.1
  Top 0.305: 90.77,25.74 91.72,24.28 91.78,23.39 QOF5.3
  Top 0.406: RD5.1 90.7,25.85 | RD5.1 90.75,25.88 | 90.77,25.74 RD5.1
N$96
  Top 0.203: IC1.5 106.38,15.16 101.47,17.8 100.01,17.99 87.98,18.75 82.22,19.65 77.85,19.17 58.67,19.4 41.02,19.74 39.37,20.59 38.19,20.5 36.91,20.42 35.36,20.35 25.94,20.37 24.98,21.7 CON2.2
N$98
  Top 0.203: IC1.4 107.65,14.96 102.37,18.14 100.09,18.49 88.08,19.21 82.28,20.13 78.03,19.61 68.43,19.71 58.99,19.84 46.95,20.06 46.51,20.24 46.55,20.87 CON3.2
N$101
  Top 0.203: RADC1.1 10.16,14.78 U$8.1 7.02,14.72 6.24,15.25 6.21,16.15 U$8.4
N$106
  Bottom 0.406: RP1.1 14.74,35.45 CP1.1
N$107
  Bottom 0.406: RP3.2 56.63,35.04 CP3.1
N$109
  Bottom 0.406: RP4.2 76.97,35.35 77,33.72 CP4.1
N$110
  Bottom 0.406: RP5.2 97.88,35.08 CP5.1
N$111
  Bottom 0.406: RP6.2 119.24,34.84 CP6.1
N$127
  Top 0.203: QOF6.3 114.38,22.49 115.56,22.07 QON6.1
  Top 0.305: RD6.1 112.87,24.36 QOF6.3
N$129
  Top 0.203: IC1.1 111.48,15.55 110.03,16.2 109.83,19.53 109.86,20.45 CON6.2
NSS-RCLK  (via drill 0.6)
  Top 0.203: U$1.6 13.18,4.53 13.14,4.32 13.18,3.65 14.63,2.06 35.72,2 102.8,1.84 104.65,1.02 v106.17,1.37 | v106.35,4.38 106.36,7.61 | v119.02,4.45 IC7.12
  Top 0.406: 106.36,7.61 IC1.12
  Bottom 0.203: v106.17,1.37 v106.35,4.38 106.98,4.48 v119.02,4.45
Q1-D-RY
  Top 0.61: Q1.3 92.62,9.46 90.68,8.14 JP2.2 90.62,8.12 93.17,7.15 96.18,7.15 D8.A
Q1-DIODE
  Top 0.61: D8.C 94.53,5.24 JP2.3
QDFLY1
  Bottom 0.406: RYC1.- 6.65,33.89 Z1.3 7.77,34.12 QFLY1.3
QDFLY2
  Bottom 0.406: RYC2.- 25.89,29.8 27.32,33.72 Z2.3 28.51,33.72 QFLY2.3
QDFLY3
  Bottom 0.406: RYC3.- 47.93,33.61 Z3.3 49.29,33.72 QFLY3.3
QDFLY4
  Bottom 0.406: RYC4.- 67.79,33.82 Z4.3 69.11,33.78 QFLY4.3
QDFLY5
  Bottom 0.406: QFLY5.3 87.99,33.89 Z5.3 88.63,29.57 RYC5.-
QDFLY6
  Bottom 0.406: QFLY6.3 110.46,33.68 Z6.3 109.51,29.7 RYC6.-
SCLK-SCLK  (via drill 0.6)
  Top 0.203: U$1.3 14.46,6.95 14.48,4.5 14.59,4.25 15.16,3.34 15.9,2.64 103.02,2.47 v104.82,2.08 | v105.11,5.48 105.02,7.57 | v117.74,5.51 IC7.11
  Top 0.406: 105.02,7.57 IC1.11
  Bottom 0.203: v104.82,2.08 v105.11,5.48 | 105.07,5.44 v117.74,5.51
  Bottom 0.406: v105.11,5.48 105.07,5.44
SER1
  Bottom 0.203: JP3.1 34.53,7.5 32.32,8.8 30.28,8.77 28.55,7.55 JP1.3 28.57,7.53 27.06,8.85 22.96,10.76 17.58,10.92 17.13,8.97 17.13,7.59 16.67,7.15 8.87,7.13 8.08,8.33 U$1.9
SER1OUT
  Top 0.203: IC1.14 108.95,5.92 115.24,5.92 115.27,7.67 IC7.9
SER2
  Bottom 0.203: JP3.3 34.3,5.05 31.84,3.74 29.41,3.81 28.57,5.07 JP1.5 27.41,3.72 21.23,3.84 19.56,7.03 17.65,7.03 17.06,6.22 17.09,5.05 16.2,3.96 9.08,4.03 8.14,5.86 U$1.10
SER2-LED-GRN
  Top 0.203: 122.81,7.6 IC7.15 122.87,7.63 122.87,4.11 126.47,4.12 R9.2
SER-IN  (via drill 0.6)
  Top 0.203: v121.63,3.18 104.3,3.15 103.5,3.11 34.89,3.11 31.04,3.11 31.04,3.09 JP1.6 31.11,4.93 JP1.4 | IC7.14 121.52,7.63 v121.54,5.69 | JP1.4 | JP1.4 JP1.2
  Bottom 0.203: v121.63,3.18 121.62,3.99 v121.54,5.69
SER-OUT
  Top 0.203: JP3.2 38.43,4.94 JP3.4 38.4,5.01 40.06,3.55 99.2,3.64 102.62,5.98 IC1.9
SR1-FETGATE  (via drill 0.6)
  Top 0.203: Q1.1 96.69,8.53 97.28,8.74 R3.1 | R3.1 97.31,7.99 v98.13,7.42 | IC1.7 103.81,11.89 99.34,10.77 98.47,8.54 97.3,8.54 R3.1
SR2-LED-RED
  Top 0.203: 124.11,13.94 IC7.1 124.17,14.85 125.49,15.22 126.64,15.19 R8.2
Z0
  Top 0.305: J7.1 29.09,12.19 48.42,9.74 50.93,9.08 U$5.1
  pour Top: 44.23,18.44 83.19,18.7 84.49,18.11 84.09,12.22 82.35,6.51 80.32,4.71 77.69,3.68 47.24,3.72 44.57,4.66 43.89,6.4
Z1  (via drill 0.6)
  Top 0.203: U$5.2
  Top 0.406: U$5.2 50.78,11.65 | v45.22,11.77 48.88,11.69 U$5.2
  Bottom 0.406: v45.22,11.77 44.75,12.72 43.76,13.53 35.81,17.41 21.02,19.2 J1.1
Z2  (via drill 0.6)
  Top 0.406: v50.19,13.56 51.27,13.54 51.74,13.42 52.08,13.03 52.01,12.54 52,10.45 53.24,9.06 U$5.3
  Bottom 0.406: J2.1 45.09,16.45 48.15,14.55 v50.19,13.56
Z3  (via drill 0.6)
  Top 0.406: v59.81,15.91 57.28,15.81 55.06,15.5 53.34,11.69 U$5.4
  Bottom 0.406: v59.81,15.91 J3.1
Z4  (via drill 0.6)
  Top 0.406: v76.24,6.43 75.67,6.65 66.32,6.55 66.11,5.76 64.83,5.22 58.8,5.25 56.09,5.2 v55.6,4.83
  Bottom 0.203: 55.74,7.98 55.81,8.17 55.83,9.1 U$5.5
  Bottom 0.406: v76.24,6.43 76.93,10.49 76.59,13.22 80.01,20.76 J4.1 | v55.6,4.83 55.59,6.42 55.74,7.98
Z5  (via drill 0.6)
  Top 0.406: v56.04,14.52 57.6,14.91 72.76,14.85 80.1,14.39 v83.41,16.66
  Bottom 0.406: J5.1 100.46,18.84 85.18,17.25 v83.41,16.66 | U$5.6 55.86,11.68 55.81,12.98 v56.04,14.52
Z6  (via drill 0.6)
  Top 0.406: v82.83,12.91 76.69,13.51 72.49,14.21 57.82,14.26 57.05,12.72 57.07,10.36 58.35,9.03 U$5.7
  Bottom 0.406: J6.1 121.06,19.74 102.99,15.99 87.9,14.36 85.27,14.33 82.82,13.06 v82.83,12.91
Z7  (via drill 0.6)
  Top 0.406: v46.63,8.41 49.61,7.06 v57.01,7.44 | v39.52,17.5 v38.12,15.04
  Bottom 0.203: 57.06,10.4 57.06,10.41 | 39.52,17.44 39.52,17.43 v39.52,17.5
  Bottom 0.406: 57.06,10.41 U$5.8 | J1.3 21.54,20.3 36.39,18.34 39.52,17.44 40.42,16.7 46.44,13.25 v46.63,8.41 | v57.01,7.44 56.91,7.16 57.11,8.5 57.06,10.4 | J7.3 31.39,14.94 33.85,15.09 v38.12,15.04
Z8  (via drill 0.6)
  Top 0.406: v46.21,17.02 47.97,15.52 51.7,15.47 v53.3,15.46 | v59.63,13.19 59.6,12.58 59.63,10.64 60.99,9.09 U$5.9
  Bottom 0.406: J2.3 v46.21,17.02 | v53.3,15.46 56.39,15.59 v59.63,13.19
Z9
  Bottom 0.406: 59.64,10.45 U$5.10 60.92,11.7 60.97,13.05 61.18,15.66 61.01,17.73 J3.3
Z10  (via drill 0.6)
  Top 0.406: v64.48,16.32 69.65,15.99 v79.25,15.99 | v64.7,13.18 64.72,12.47 64.7,10.57 63.45,9.08 U$5.11
  Bottom 0.406: v79.25,15.99 J4.3 | v64.7,13.18 v64.48,16.32
Z11  (via drill 0.6)
  Top 0.406: v62.19,7.29 75.23,7.28 76.29,7.51 v78.48,7.3
  Bottom 0.203: 62.15,10.46 62.19,10.43
  Bottom 0.406: 62.15,10.39 62.19,10.43 U$5.12 | v78.48,7.3 78.03,11.31 80.83,14.13 84.24,15.92 86.21,16.32 101.52,17.71 J5.3 | v62.19,7.29 61.98,7.19 61.98,7.66 62.21,8.48 62.15,10.46
Z12  (via drill 0.6)
  Top 0.406: v67.9,4.98 75.39,4.94 77.37,4.86 v80.34,6.35
  Bottom 0.203: U$5.13 65.98,9.08 65.88,8.03
  Bottom 0.406: v80.34,6.35 80.09,8.85 80.48,9.73 81.75,11.11 88.76,13.43 103.02,14.98 121.46,19.14 J6.3 | v67.9,4.98 66.2,6.99 65.88,8.03
Z13  (via drill 0.6)
  Top 0.203: J7.5 33.86,15.29 36.23,16.57 v38.89,19.07
  Top 0.406: v48.5,5.35 55.45,5.97 v64.62,6.22
  Bottom 0.203: 64.68,10.46 64.72,10.43 | 38.83,18.69 38.82,18.65 | 38.7,18.71 38.71,18.76 v38.89,19.07
  Bottom 0.406: 64.7,10.41 64.72,10.43 U$5.14 | v48.5,5.35 47.47,13.45 40.27,18.35 38.83,18.69 38.7,18.71 36.78,19.16 J1.5 | v64.62,6.22 64.52,6.92 64.53,7.58 64.7,8.42 64.68,10.46
Z14  (via drill 0.6)
  Top 0.406: v49.19,17.07 59.6,17.6 v62.75,17.5 | v67.23,13.2 67.23,12.48 67.27,10.45 68.44,9.17 U$5.15
  Bottom 0.406: J2.5 v49.19,17.07 | v62.75,17.5 64.66,17.71 66.02,17.22 v67.23,13.2
Z15
  Bottom 0.406: J3.5 67.16,17.7 68.58,13.78 68.63,12.02 68.36,11.89 U$5.16
Z16  (via drill 0.6)
  Top 0.406: v71.82,17.44 v81.83,17.79 | v69.76,13.29 70.34,12.92 69.8,12.77 69.79,10.6 U$5.17
  Bottom 0.406: v81.83,17.79 J4.5 | v69.76,13.29 v71.82,17.44
Z17  (via drill 0.6)
  Top 0.203: 75.74,10.51 75.64,10.56 v75.64,10.5
  Top 0.406: 75.74,10.51 v79.63,10.78
  Bottom 0.203: 74.95,10.38 v75.64,10.5
  Bottom 0.406: U$5.18 72.24,10.38 74.95,10.38 | v79.63,10.78 81.36,13.4 84.52,15.16 86.9,15.29 102,16.83 J5.5

### Text on the board
bNames: 5
tValues: 3.3V | DIGITAL | +5V | 3.2v | ANALOG | 3.2